# EAGLE design Front_panel_owon_extended (EAGLE 9.5.2)
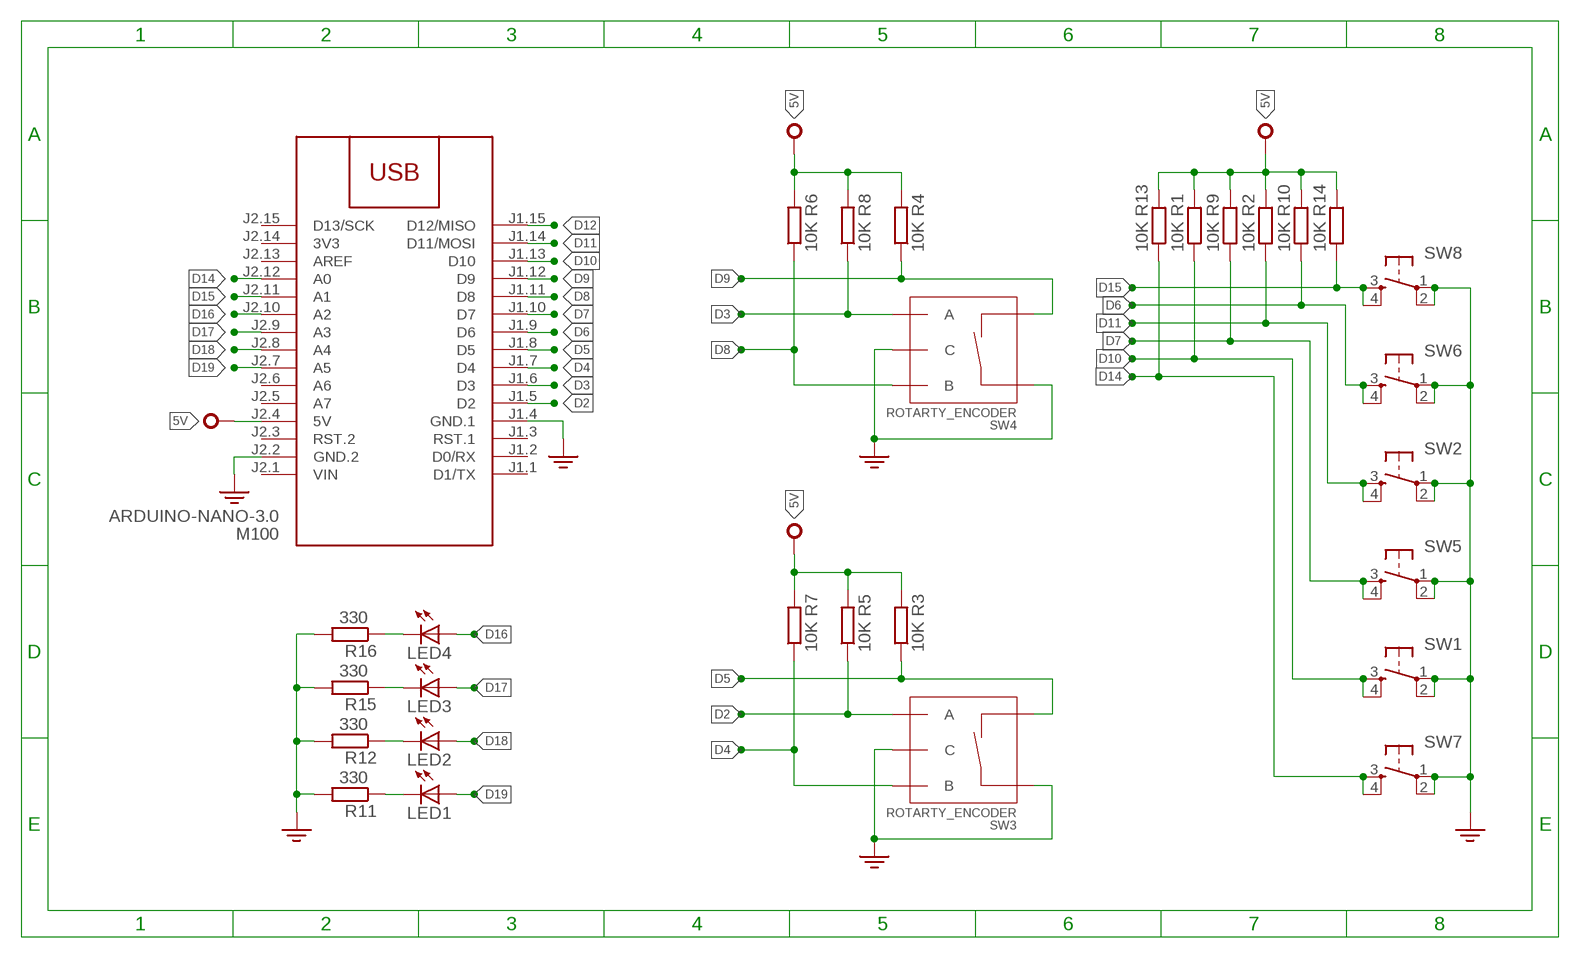
[diagram p0: schematic, sheet 1]

## Parts
LED1  LED5MM  [LED5MM]
LED2  LED5MM  [LED5MM]
LED3  LED5MM  [LED5MM]
LED4  LED5MM  [LED5MM]
M100  ARDUINO-NANO-3.0  [ARDUINO-NANO-3.0]
R1  10K  R-EU_0204/7  [0204/7]
R2  10K  R-EU_0204/7  [0204/7]
R3  10K  R-EU_0204/7  [0204/7]
R4  10K  R-EU_0204/7  [0204/7]
R5  10K  R-EU_0204/7  [0204/7]
R6  10K  R-EU_0204/7  [0204/7]
R7  10K  R-EU_0204/7  [0204/7]
R8  10K  R-EU_0204/7  [0204/7]
R9  10K  R-EU_0204/7  [0204/7]
R10  10K  R-EU_0204/7  [0204/7]
R11  330  R-EU_0204/7  [0204/7]
R12  330  R-EU_0204/7  [0204/7]
R13  10K  R-EU_0204/7  [0204/7]
R14  10K  R-EU_0204/7  [0204/7]
R15  330  R-EU_0204/7  [0204/7]
R16  330  R-EU_0204/7  [0204/7]
SW1  TACTILE-SWITCH-PTH  [TAC-SWITCH-PTH]
SW2  TACTILE-SWITCH-PTH  [TAC-SWITCH-PTH]
SW3  ROTARTY_ENCODER  [ROTARY_ENC_PLAIN]
SW4  ROTARTY_ENCODER  [ROTARY_ENC_PLAIN]
SW5  TACTILE-SWITCH-PTH  [TAC-SWITCH-PTH]
SW6  TACTILE-SWITCH-PTH  [TAC-SWITCH-PTH]
SW7  TACTILE-SWITCH-PTH  [TAC-SWITCH-PTH]
SW8  TACTILE-SWITCH-PTH  [TAC-SWITCH-PTH]

## Nets
5V: M100.J2.4(5V) R1.2 R2.2 R3.2 R4.2 R5.2 R6.2 R7.2 R8.2 R9.2 R10.2 R13.2 R14.2 ; supply symbol labelled PWR_VIN
D2: M100.J1.5(D2) R5.1 SW3.A
D3: M100.J1.6(D3) R8.1 SW4.A
D4: M100.J1.7(D4) R7.1 SW3.B
D5: M100.J1.8(D5) R3.1 SW3.SW-
D6: M100.J1.9(D6) R10.1 SW6.3 SW6.4
D7: M100.J1.10(D7) R9.1 SW5.3 SW5.4
D8: M100.J1.11(D8) R6.1 SW4.B
D9: M100.J1.12(D9) R4.1 SW4.SW-
D10: M100.J1.13(D10) R1.1 SW1.3 SW1.4
D11: M100.J1.14(D11/MOSI) R2.1 SW2.3 SW2.4
D12: M100.J1.15(D12/MISO)
D14: M100.J2.12(A0) R13.1 SW7.3 SW7.4
D15: M100.J2.11(A1) R14.1 SW8.3 SW8.4
D16: LED4.A M100.J2.10(A2)
D17: LED3.A M100.J2.9(A3)
D18: LED2.A M100.J2.8(A4)
D19: LED1.A M100.J2.7(A5)
GND: M100.J1.4(GND.1) M100.J2.2(GND.2) R11.2 R12.2 R15.2 R16.2 SW1.1 SW1.2 SW2.1 SW2.2 SW3.C SW3.SW+ SW4.C SW4.SW+ SW5.1 SW5.2 SW6.1 SW6.2 SW7.1 SW7.2 SW8.1 SW8.2 ; supply symbol labelled GND2
N$1: LED1.K(C) R11.1
N$2: LED2.K(C) R12.1
N$3: LED3.K(C) R15.1
N$4: LED4.K(C) R16.1
Unconnected: M100.J1.1(D1/TX) M100.J1.2(D0/RX) M100.J1.3(RST.1) M100.J2.3(RST.2) M100.J2.5(A7) M100.J2.6(A6) M100.J2.13(AREF) M100.J2.15(D13/SCK)

## Power pins joined to a net without a drawn wire
3V3: M100.J2.14(3V3)
VIN: M100.J2.1(VIN)

## Library data of the parts
LED1-LED4 = adafruit:LED: LED OSRAM: - CHIPLED LG R971, LG N971, LY N971, LG Q971, LY Q971, LO R971, LY R971 LH N974, LH R974 LS Q976, LO Q976, LY Q976 LO Q996 - Hyper CHIPLED LW Q18S LB Q993, LB Q99A, LB R99A - SideLED LS A670, LO A670, LY A670, LG A670, LP A670 LB A673, LV A673, LT A673, LW A673 LH A674 LY A675 LS A676, LA A676, LO A676, LY A676, LW A676 LS A679, LY A679, LG A679 - Hyper Micro SIDELED® LS Y876, LA Y876, LO Y876, LY Y876 LT Y87S - SmartLED LW L88C, LW L88S LB L89C, LB L89S, LG L890 LS L89K, LO L89K, LY L89K LS L896, LA L896, LO L896, LY L896 - TOPLED LS T670, LO T670, LY T670, LG T670, LP T670 LSG T670, LSP T670, LSY T670, LOP T670, LYG T670 LG T671, LOG T671, LSG T671 LB T673, LV T673, LT T673, LW T673 LH T674 LS T676, LA T676, LO T676, LY T676, LB T676, LH T676, LSB T676, LW T676 LB T67C, LV T67C, LT T67C, LS T67K, LO T67K, LY T67K, LW E67C LS E67B, LA E67B, LO E67B, LY E67B, LB E67C, LV E67C, LT E67C LW T67C LS T679, LY T679, LG T679 LS T770, LO T770, LY T770, LG T770, LP T770 LB T773, LV T773, LT T773, LW T773 LH T774 LS E675, LA E675, LY E675, LS T675 LS T776, LA T776, LO T776, LY T776, LB T776 LHGB T686 LT T68C, LB T68C - Hyper Mini TOPLED® LB M676 - Mini TOPLED Santana® LG M470 LS M47K, LO M47K, LY M47K Source: http://www.osram.convergy.de/
M100 = diy-modules:ARDUINO-NANO-3.0: Arduino Nano 3.0 and compatible devices More details available here: https://www.arduino.cc/en/Main/ArduinoBoardNano Click here to find device on ebay.com <http://www.ebay.com/sch/arduino+nano>
R1-R16 = rcl:R-EU_: RESISTOR, European symbol; SPICEPREFIX: R
SW1 SW2 SW5-SW8 = GeekAmmo:TACTILE-SWITCH: Tactile Switch 4 Pins, SPST NO
SW3 SW4 = SparkFun-Electromechanical:ROTARTY_ENCODER: Simple no LED rotary encoder Example: COM-09117

## Board
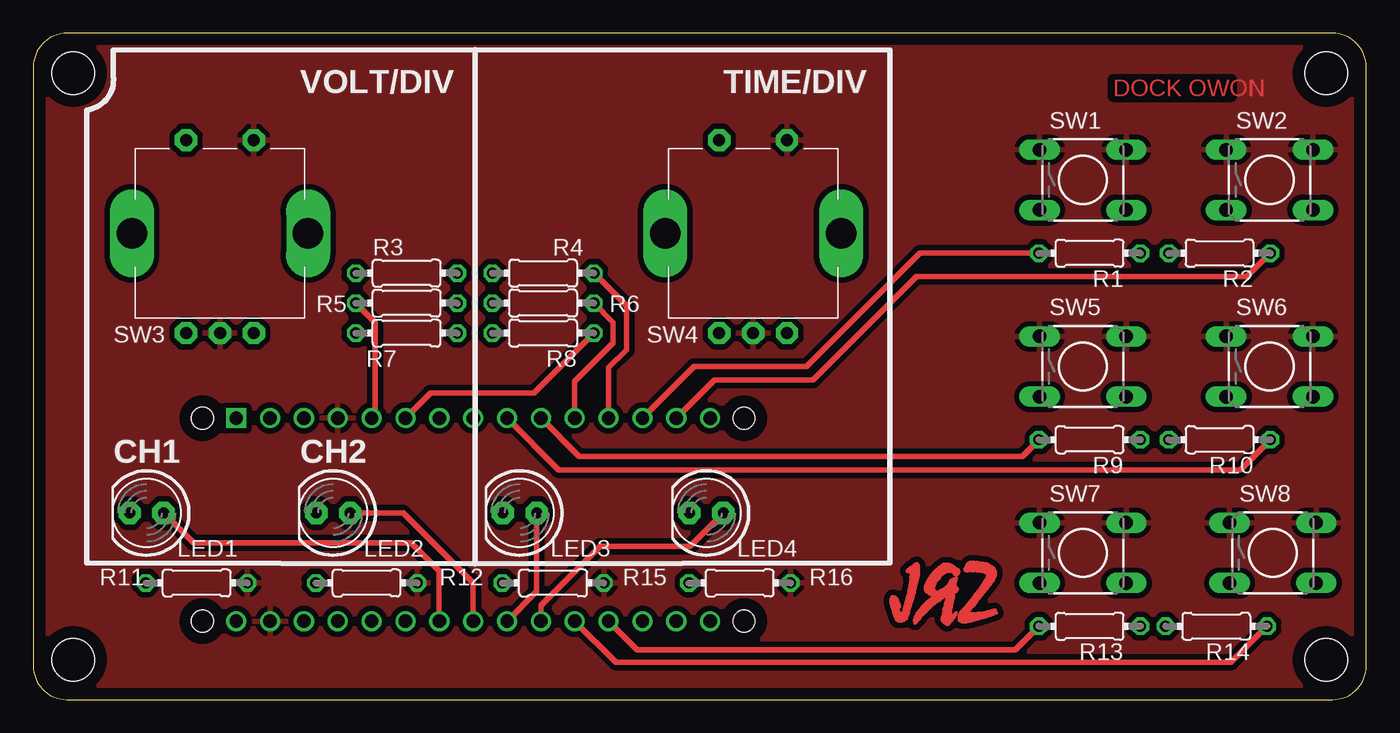
[diagram p1: board, top side]
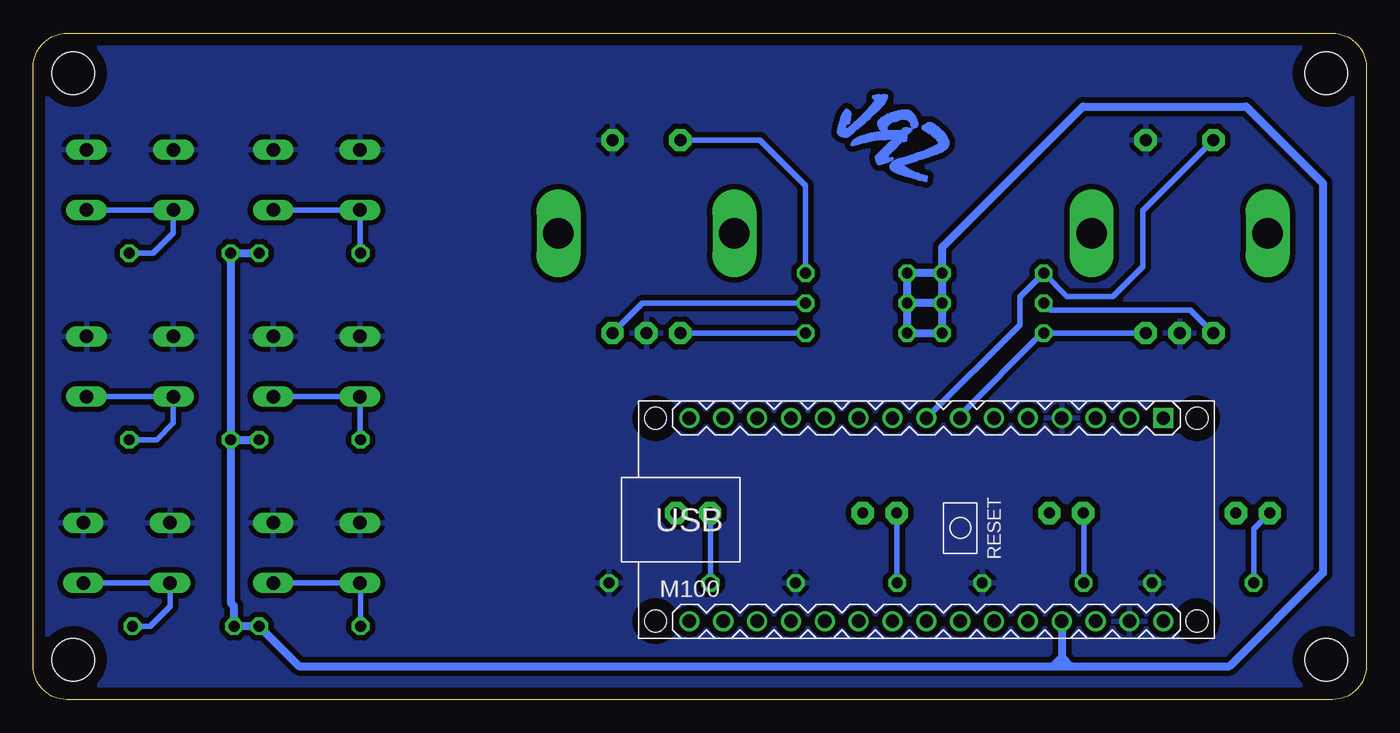
[diagram p2: board, bottom side, seen from below]

Size 100 x 50 mm. Coordinates in mm from the lower left corner, seen from the top.
Outline: 97.5,50 2.5,50 arc90 0,47.5 0,2.5 arc90 2.5,0 97.5,0 arc90 100,2.5 100,47.5 arc90 97.5,50
Copper layers (1*16): Top 0.035mm / dielectric 1.5mm / Bottom 0.035mm
Design rules "default *": minimum track width 6mil, minimum drill 0.35mm, track to track 0.4mm, track to pad 0.3mm, pad to pad 0.3mm, via to via 0.3mm, smd to smd 6mil, copper to edge 35mil, drill to drill 5mil, minimum pad ring 10mil, minimum via ring 8mil, stop-mask expansion 4mil, vias tented up to drill 0mil, thermal gap 15mil
Holes 3.2 mm at 3,3 3,47 97,47 97,3

### Footprints (pad centres in the part's own frame; a part is rotated, then mirrored left to right if it is on the bottom)
LED5MM = drill 0.813 pad 1.676 octagon: A -1.27,0; K 1.27,0
ARDUINO-NANO-3.0 = drill 1 square: J1.1 17.78,7.62 | drill 1: J1.2 15.24,7.62; J1.3 12.7,7.62; J1.4 10.16,7.62; J1.5 7.62,7.62; J1.6 5.08,7.62; J1.7 2.54,7.62; J1.8 0,7.62; J1.9 -2.54,7.62; J1.10 -5.08,7.62; J1.11 -7.62,7.62; J1.12 -10.16,7.62; J1.13 -12.7,7.62; J1.14 -15.24,7.62; J1.15 -17.78,7.62; J2.1 17.78,-7.62; J2.2 15.24,-7.62; J2.3 12.7,-7.62; J2.4 10.16,-7.62; J2.5 7.62,-7.62; J2.6 5.08,-7.62; J2.7 2.54,-7.62; J2.8 0,-7.62; J2.9 -2.54,-7.62; J2.10 -5.08,-7.62; J2.11 -7.62,-7.62; J2.12 -10.16,-7.62; J2.13 -12.7,-7.62; J2.14 -15.24,-7.62; J2.15 -17.78,-7.62 | hole 1.651: -20.32,7.62; -20.32,-7.62; 20.32,-7.62; 20.32,7.62
0204/7 = drill 0.813 octagon: 1 -3.81,0; 2 3.81,0
TAC-SWITCH-PTH = drill 1.016 pad 1.524 long: 1 -3.251,2.261; 2 3.251,2.261; 3 -3.251,-2.261; 4 3.251,-2.261
ROTARY_ENC_PLAIN = drill 0.9 pad 1.676 octagon: A -2.54,-7.493; B 2.54,-7.493; C 0,-7.493; SW+ 2.54,6.985; SW- -2.54,6.985 | drill 2.286 long: P$3 6.604,0; P$4 -6.604,0

### Placement (x,y rotation side)
LED1  8.5,14 180 top
LED2  22.5,14 180 top
LED3  36.5,14 180 top
LED4  50.5,14 180 top
M100  33,13.5 0 bottom
R1  79.25,33.5 0 top
R2  89,33.5 180 top
R3  28,32 0 top
R4  38.25,32 180 top
R5  28,29.75 0 top
R6  38.25,29.75 180 top
R7  28,27.5 0 top
R8  38.25,27.5 180 top
R9  79.25,19.5 0 top
R10  89,19.5 180 top
R11  12.25,8.75 0 top
R12  25,8.75 0 top
R13  79.25,5.5 0 top
R14  88.75,5.5 180 top
R15  39,8.75 0 top
R16  53,8.75 0 top
SW1  78.75,39 0 top
SW2  92.75,39 0 top
SW3  14,35 0 top
SW4  54,35 0 top
SW5  78.75,25 0 top
SW6  92.75,25 0 top
SW7  78.75,11 0 top
SW8  93,11 0 top
U$1  [LOGO_B]  68.95,7.98 0 bottom
U$3  [LOGO_B]  35,42 33 top

### Tracks (layer width: path | path; a pad name or v marks a point on that pad's centre or on a via)
5V
  Bottom 0.61: R10.2 85.19,7.25 84.94,7 R14.2 R13.2 80.06,2.5 23.5,2.5 | R10.2 R9.2 | R10.2 R2.2 R1.2 | R5.2 R7.2 R8.2 R6.2 | R5.2 R3.2 | R3.2 R4.2 R6.2 | R5.2 R6.2 | M100.J2.4 22.84,3.16 | 22.84,3.16 23.5,2.5 | 22.84,3.16 22.18,2.5 | R3.2 31.81,33.94 21.25,44.5 9,44.5 3.25,38.75 3.25,9.5 10.25,2.5 23.5,2.5
D2
  Top 0.406: M100.J1.5 25.63,21.37 25.63,28.31 R5.1
  Bottom 0.406: R5.1 23.69,29.25 13.2,29.25 SW3.A
D3
  Top 0.406: R8.1 37.56,23 29.8,23 M100.J1.6
  Bottom 0.406: R8.1 SW4.A
D4
  Bottom 0.406: SW3.B R7.1 24.33,27.5 30.46,21.37 M100.J1.7
D5
  Bottom 0.406: M100.J1.8 26,28.12 26,30.19 R3.1 22.44,30.25 19,30.25 16.75,32.5 16.75,36.7 SW3.SW-
D6
  Top 0.406: M100.J1.9 39.41,17.25 90.56,17.25 R10.1
  Bottom 0.406: R10.1 90.75,19.5 89.5,20.75 SW6.3 SW6.4
D7
  Top 0.406: M100.J1.10 40.95,18.25 74.19,18.25 R9.1
  Bottom 0.406: R9.1 75.5,19.56 SW5.3 SW5.4
D8
  Top 0.406: R6.1 43.5,28.31 43.5,26.75 40.62,23.87 M100.J1.11
  Bottom 0.406: R6.1 54.3,29.75 SW4.B
D9
  Top 0.406: R4.1 44.5,29.56 44.5,26.25 43.16,24.91 M100.J1.12
  Bottom 0.406: R4.1 42.06,38.56 45.48,41.98 SW4.SW-
D10
  Top 0.406: R1.1 66.5,33.5 58,25 49.58,25 M100.J1.13
  Bottom 0.406: SW1.4 SW1.3 75.5,33.56 R1.1
D11
  Top 0.406: M100.J1.14 51.12,24 58.5,24 66.25,31.75 90.75,31.75 91.06,31.75 R2.1
  Bottom 0.406: R2.1 91,33.5 89.5,35 SW2.3 SW2.4
D14
  Top 0.406: R13.1 73.69,3.75 45.29,3.75 M100.J2.12
  Bottom 0.406: R13.1 75.44,8.68 SW7.3 SW7.4
D15
  Top 0.406: M100.J2.11 43.71,2.79 89.85,2.79 R14.1
  Bottom 0.406: R14.1 91.25,5.5 89.75,7 SW8.3 SW8.4
D16
  Top 0.406: M100.J2.10 38.08,7.08 42.5,11.5 49.27,11.5 LED4.A
D17
  Top 0.406: LED3.A 37.77,8.11 M100.J2.9
D18
  Top 0.406: M100.J2.8 33,8.75 27.75,14 LED2.A
D19
  Top 0.406: LED1.A 12.02,11.75 28.36,11.75 30.46,9.65 M100.J2.7
GND
  pour Top (isolate 0.406): -1.5,51.5 102,51.5 102,-1.5 -1.5,-1.5
  pour Bottom (isolate 0.406): -1.5,51.5 102,51.5 102,-1.5 -1.5,-1.5
N$1
  Bottom 0.406: LED1.K 8.44,12.79 R11.1
N$2
  Bottom 0.406: R12.1 21.19,13.96 LED2.K
N$3
  Bottom 0.406: R15.1 35.19,13.96 LED3.K
N$4
  Bottom 0.406: R16.1 49.19,13.96 LED4.K

### Text on the board
Top: DOCK OWON
tPlace: VOLT/DIV | TIME/DIV | SW3 | SW4 | CH1 | CH2